# Altium project ESC_control.PrjPCB
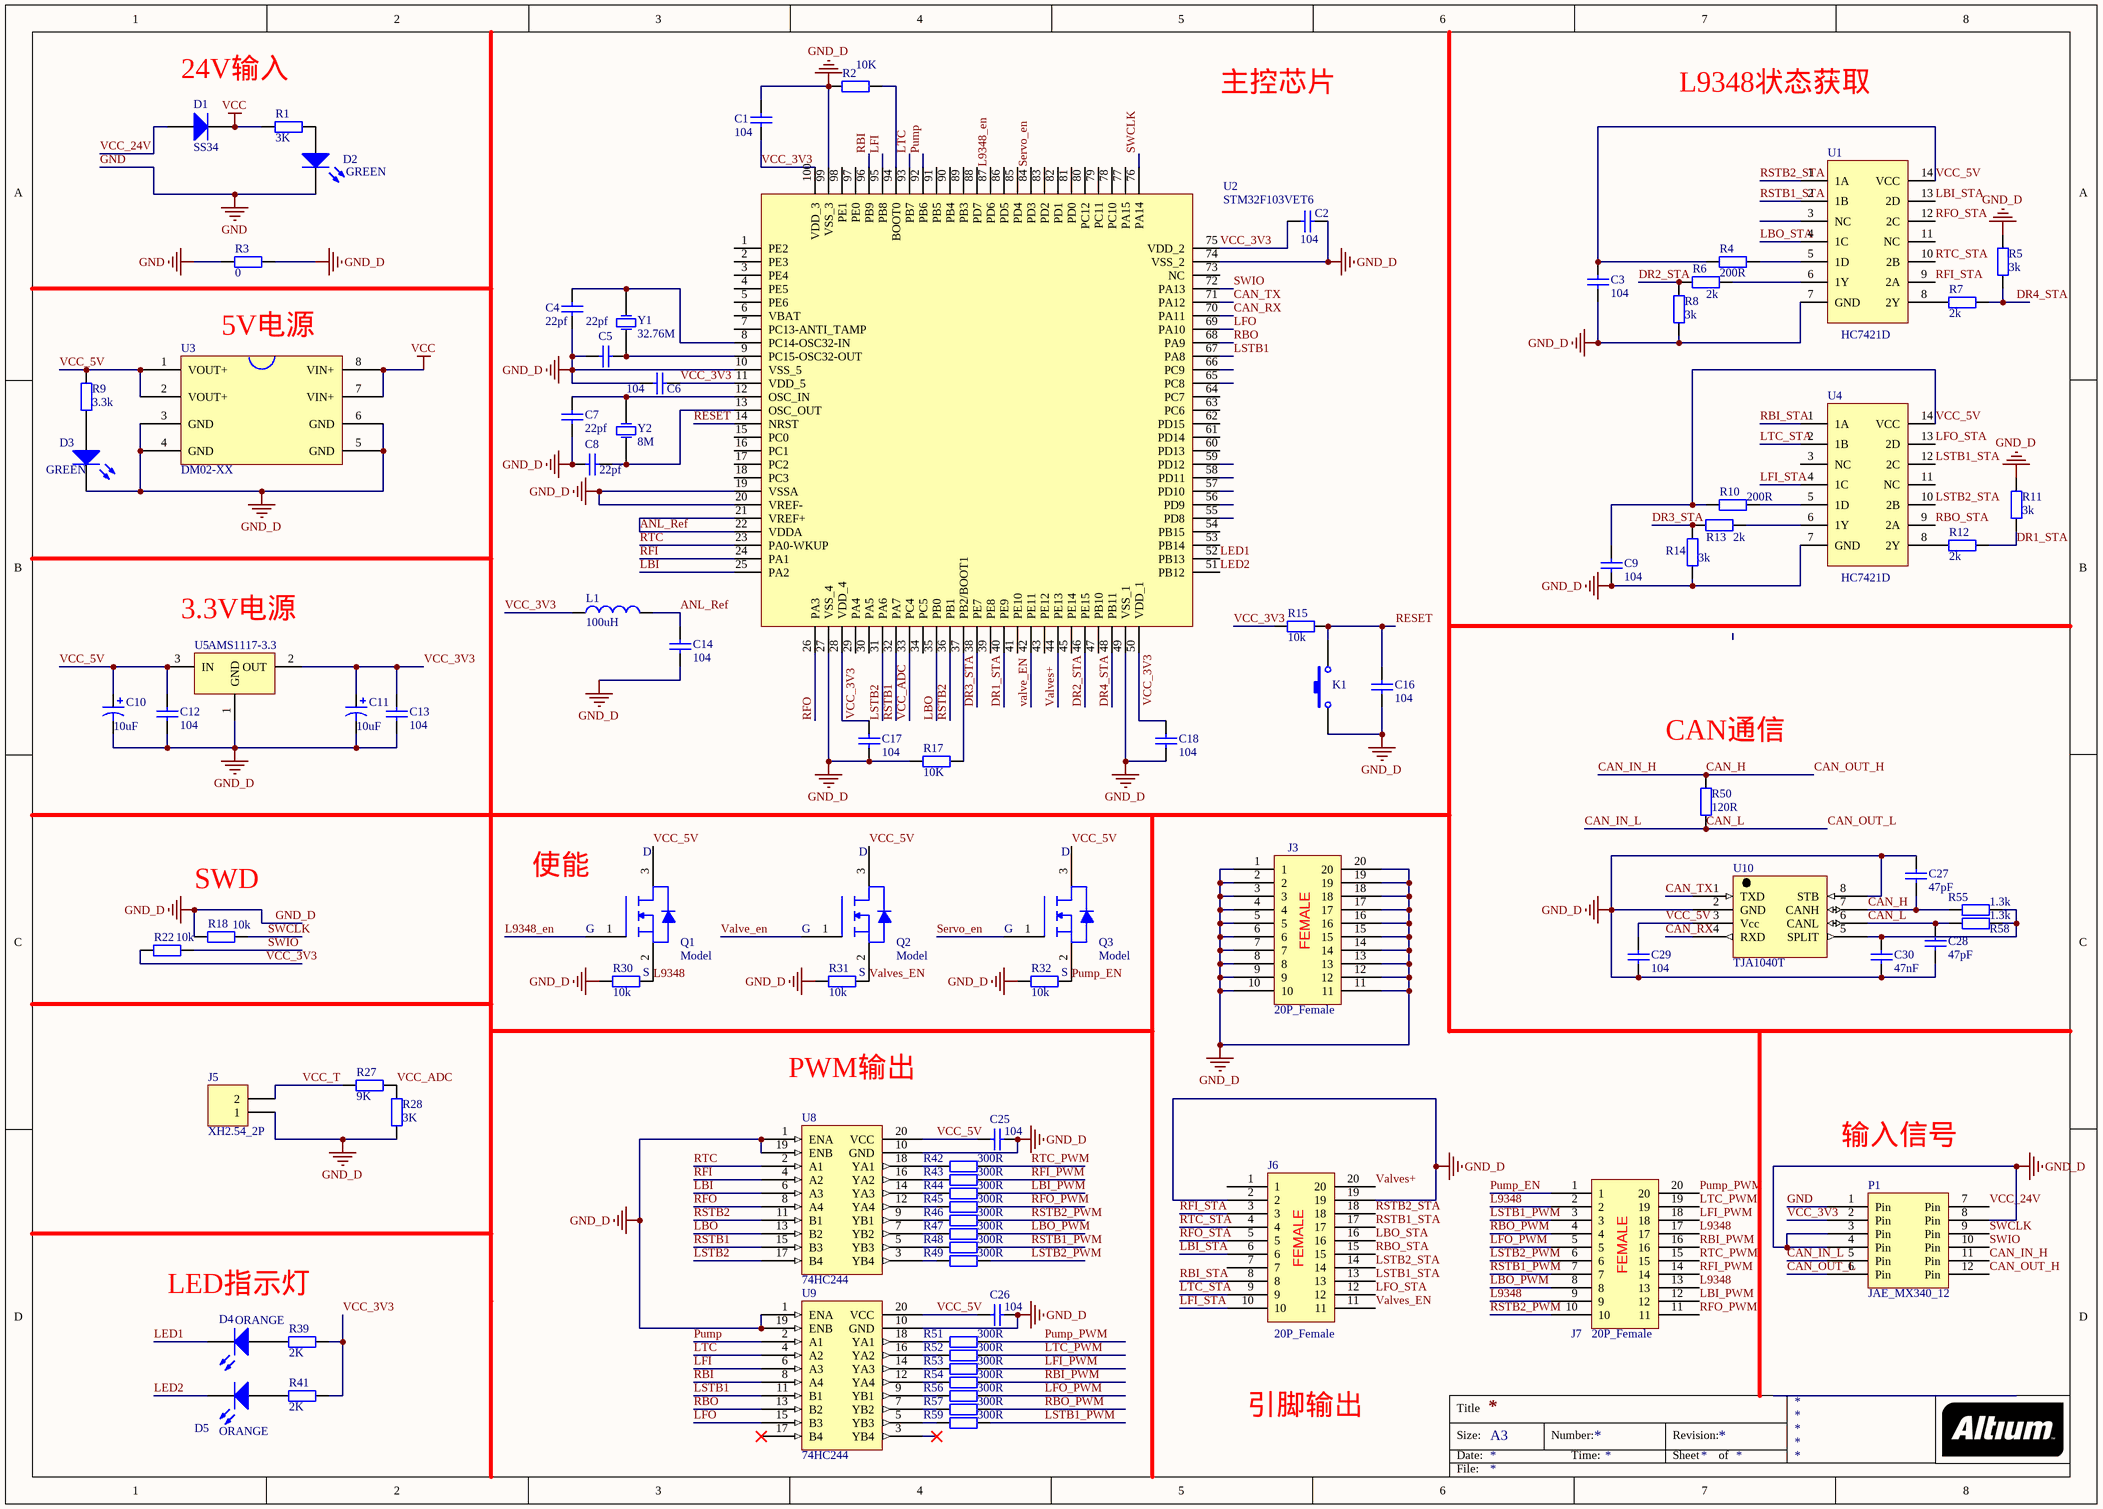
[diagram p0: Controller.SchDoc]
1 sheet, 91 parts. Net scope: global (net labels, ports and power ports of the same name join across sheets).
Board file: ESC_con.PcbDoc

## Sheet Controller.SchDoc
size A3

### Parts
C1  104  [C 0805]
C2  104  [C 0805]
C3  104  [C 0805]
C4  22pf  [C 0805]
C5  22pf  [C 0805]
C6  104  [C 0805]
C7  22pf  [C 0805]
C8  22pf  [C 0805]
C9  104  [C 0805]
C10  10uF  [CP 3528B]
C11  10uF  [CP 3528B]
C12  104  [C 0805]
C13  104  [C 0805]
C14  104  [C 0805]
C16  104  [C 0805]
C17  104  [C 0805]
C18  104  [C 0805]
C25  104  [C 0805]
C26  104  [C 0805]
C27  47pF  [C 0805]
C28  47pF  [C 0805]
C29  104  [C 0805]
C30  47nF  [C 0805]
D1  SS34  [DO-214]
D2  GREEN  [LED_0805]
D3  GREEN  [LED_0805]
D4  ORANGE  [LED_0805]
D5  ORANGE  [LED_0805]
J3  20P_Female  [B2B_1.27_Female]
J5  XH2.54_2P  [XH2.54_2P_SMT]
J6  20P_Female  [B2B_1.27_Female]
J7  20P_Female  [B2B_1.27_Female]
K1  Key  [KEY 3.6*2.5 SMD]  (value not drawn)
L1  100uH  [L 0805]
P1  JAE_MX340_12  [JAE_MX34_2.2_12]
Q1  Model  [SOT23-3]
Q2  Model  [SOT23-3]
Q3  Model  [SOT23-3]
R1  3K  [R 0805]
R2  10K  [R 0805]
R3  0  [R 1206]
R4  200R  [R 0805]
R5  3k  [R 0805]
R6  2k  [R 0805]
R7  2k  [R 0805]
R8  3k  [R 0805]
R9  3.3k  [R 0805]
R10  200R  [R 0805]
R11  3k  [R 0805]
R12  2k  [R 0805]
R13  2k  [R 0805]
R14  3k  [R 0805]
R15  10k  [R 0805]
R17  10K  [R 0805]
R18  10k  [R 0805]
R22  10k  [R 0805]
R27  9K  [R 0805]
R28  3K  [R 0805]
R30  10k  [R 0805]
R31  10k  [R 0805]
R32  10k  [R 0805]
R39  2K  [R 0805]
R41  2K  [R 0805]
R42  300R  [R 0805]
R43  300R  [R 0805]
R44  300R  [R 0805]
R45  300R  [R 0805]
R46  300R  [R 0805]
R47  300R  [R 0805]
R48  300R  [R 0805]
R49  300R  [R 0805]
R50  120R  [R 0805]
R51  300R  [R 0805]
R52  300R  [R 0805]
R53  300R  [R 0805]
R54  300R  [R 0805]
R55  1.3k  [R 0805]
R56  300R  [R 0805]
R57  300R  [R 0805]
R58  1.3k  [R 0805]
R59  300R  [R 0805]
U1  HC7421D  [74hc74]
U2  STM32F103VET6  [TQFP100N50P14X14X1.2]
U3  DM02-XX  [DM02]
U4  HC7421D  [74hc74]
U5  AMS1117-3.3  [SOT223]
U8  74HC244  [SSOP20]
U9  74HC244  [SSOP20]
U10  TJA1040T  [SOP8]
Y1  32.76M  [XTAL-5032]
Y2  8M  [XTAL-5032]

### Nets
GND: D2.2(K) P1.1(Pin) R3.1
GND_D: C1.2 C2.2 C3.1 C4.2 C5.1 C6.1 C7.1 C8.1 C9.1 C10.2 C11.2 C12.1 C13.1 C14.1 C16.1 C17.2 C18.2 C25.2 C26.2 C27.1 C28.2 C29.2 C30.2 D3.2(K) J3.1 J3.2 J3.3 J3.4 J3.5 J3.6 J3.7 J3.8 J3.9 J3.10 J3.11 J3.12 J3.13 J3.14 J3.15 J3.16 J3.17 J3.18 J3.19 J3.20 J5.1 J6.2 J6.19 K1.1 P1.3(Pin) P1.4(Pin) P1.8(Pin) R2.2 R3.2 R5.2 R8.2 R11.2 R14.2 R17.2 R18.1 R28.2 R30.1 R31.1 R32.1 U1.7(GND) U2.10(VSS_5) U2.19(VSSA) U2.20(VREF-) U2.27(VSS_4) U2.49(VSS_1) U2.74(VSS_2) U2.99(VSS_3) U3.3(GND) U3.4(GND) U3.5(GND) U3.6(GND) U4.7(GND) U5.1(GND) U8.1(ENA) U8.10(GND) U8.19(ENB) U9.1(ENA) U9.10(GND) U9.19(ENB) U10.2(GND) U10.8(STB)
VCC: D1.2(K) R1.2 U3.7(VIN+) U3.8(VIN+)
ANL_Ref: C14.2 L1.2 U2.21(VREF+) U2.22(VDDA)
CAN_H: C27.2 P1.11(Pin) P1.12(Pin) R50.2 R55.1 U10.7(CANH)  [also labelled CAN_IN_H, CAN_OUT_H]
CAN_IN_L: C28.1 P1.5(Pin) P1.6(Pin) R50.1 R58.1 U10.6(CANL)  [also labelled CAN_L, CAN_OUT_L]
CAN_RX: U2.70(PA11) U10.4(RXD)
CAN_TX: U2.71(PA12) U10.1(TXD)
DR1_STA: R11.1 R12.1 U2.40(PE9)
DR2_STA: R6.1 R8.1 U2.46(PE15)
DR3_STA: R13.1 R14.1 U2.38(PE7)
DR4_STA: R5.1 R7.1 U2.48(PB11)
L9348: J7.2 J7.9 J7.13 J7.17 Q1.2 R30.2
L9348_en: Q1.1(G) U2.87(PD6)
LBI: U2.25(PA2) U8.6(A3)
LBI_PWM: J7.12 R44.2
LBI_STA: J6.6 U1.13(2D)
LBO: U2.35(PB0) U8.13(B2)
LBO_PWM: J7.8 R47.2
LBO_STA: J6.16 U1.4(1C)
LED1: D4.2(K) U2.52(PB13)
LED2: D5.2(K) U2.51(PB12)
LFI: U2.95(PB8) U9.6(A3)
LFI_PWM: J7.18 R53.2
LFI_STA: J6.10 U4.4(1C)
LFO: U2.69(PA10) U9.15(B3)
LFO_PWM: J7.5 R56.2
LFO_STA: J6.12 U4.13(2D)
LSTB1: U2.67(PA8) U9.11(B1)
LSTB1_PWM: J7.3 R59.2
LSTB1_STA: J6.13 U4.12(2C)
LSTB2: U2.31(PA6) U8.17(B4)
LSTB2_PWM: J7.6 R49.2
LSTB2_STA: J6.14 U4.10(2B)
LTC: U2.93(PB7) U9.4(A2)
LTC_PWM: J7.19 R52.2
LTC_STA: J6.9 U4.2(1B)
Pump: U2.92(PB6) U9.2(A1)
Pump_EN: J7.1 Q3.2 R32.2
Pump_PWM: J7.20 R51.2
RBI: U2.96(PB9) U9.8(A4)
RBI_PWM: J7.16 R54.2
RBI_STA: J6.8 U4.1(1A)
RBO: U2.68(PA9) U9.13(B2)
RBO_PWM: J7.4 R57.2
RBO_STA: J6.15 U4.9(2A)
RESET: C16.2 K1.2 R15.2 U2.14(NRST)
RFI: U2.24(PA1) U8.4(A2)
RFI_PWM: J7.14 R43.2
RFI_STA: J6.3 U1.9(2A)
RFO: U2.26(PA3) U8.8(A4)
RFO_PWM: J7.11 R45.2
RFO_STA: J6.5 U1.12(2C)
RSTB1: U2.32(PA7) U8.15(B3)
RSTB1_PWM: J7.7 R48.2
RSTB1_STA: J6.17 U1.2(1B)
RSTB2: U2.36(PB1) U8.11(B1)
RSTB2_PWM: J7.10 R46.2
RSTB2_STA: J6.18 U1.1(1A)
RTC: U2.23(PA0-WKUP) U8.2(A1)
RTC_PWM: J7.15 R42.2
RTC_STA: J6.4 U1.10(2B)
Servo_en: Q3.1(G) U2.84(PD3)
SWCLK: P1.9(Pin) R18.2 U2.76(PA14)
SWIO: P1.10(Pin) R22.2 U2.72(PA13)
Valve_en: Q2.1(G) U2.42(PE11)
Valves+: J6.20 U2.44(PE13)
Valves_EN: J6.11 Q2.2 R31.2
VCC_3V3: C1.1 C2.1 C6.2 C11.1 C13.2 C17.1 C18.1 L1.1 P1.2(Pin) R15.1 R22.1 R39.1 R41.1 U2.11(VDD_5) U2.28(VDD_4) U2.50(VDD_1) U2.75(VDD_2) U2.100(VDD_3) U5.2(OUT)
VCC_5V: C3.2 C9.2 C10.1 C12.2 C25.1 C26.1 C29.1 Q1.3 Q2.3 Q3.3 R4.2 R9.2 R10.2 U1.14(VCC) U3.1(VOUT+) U3.2(VOUT+) U4.14(VCC) U5.3(IN) U8.20(VCC) U9.20(VCC) U10.3(Vcc)
VCC_24V: D1.1(A) P1.7(Pin)
VCC_ADC: R27.1 R28.1 U2.33(PC4)
VCC_T: J5.2 R27.2
NetC4_1: C4.1 U2.8(PC14-OSC32-IN) Y1.2(OSC2)
NetC5_2: C5.2 U2.9(PC15-OSC32-OUT) Y1.1(OSC1)
NetC7_2: C7.2 U2.12(OSC_IN) Y2.2(OSC2)
NetC8_2: C8.2 U2.13(OSC_OUT) Y2.1(OSC1)
NetC30_1: C30.1 R55.2 R58.2 U10.5(SPLIT)
NetD2_1: D2.1(A) R1.1
NetD3_1: D3.1(A) R9.1
NetD4_1: D4.1(A) R39.2
NetD5_1: D5.1(A) R41.2
NetR2_1: R2.1 U2.94(BOOT0)
NetR4_1: R4.1 U1.5(1D)
NetR6_2: R6.2 U1.6(1Y)
NetR7_2: R7.2 U1.8(2Y)
NetR10_1: R10.1 U4.5(1D)
NetR12_2: R12.2 U4.8(2Y)
NetR13_2: R13.2 U4.6(1Y)
NetR17_1: R17.1 U2.37(PB2/BOOT1)
NetR42_1: R42.1 U8.18(YA1)
NetR43_1: R43.1 U8.16(YA2)
NetR44_1: R44.1 U8.14(YA3)
NetR45_1: R45.1 U8.12(YA4)
NetR46_1: R46.1 U8.9(YB1)
NetR47_1: R47.1 U8.7(YB2)
NetR48_1: R48.1 U8.5(YB3)
NetR49_1: R49.1 U8.3(YB4)
NetR51_1: R51.1 U9.18(YA1)
NetR52_1: R52.1 U9.16(YA2)
NetR53_1: R53.1 U9.14(YA3)
NetR54_1: R54.1 U9.12(YA4)
NetR56_1: R56.1 U9.9(YB1)
NetR57_1: R57.1 U9.7(YB2)
NetR59_1: R59.1 U9.5(YB3)

Not connected (* = marked no-connect by the designer): J6 1 7; U1 3(NC) 11(NC); U2 1(PE2) 2(PE3) 3(PE4) 4(PE5) 5(PE6) 6(VBAT) 7(PC13-ANTI_TAMP) 15(PC0) 16(PC1) 17(PC2) 18(PC3) 29(PA4) 30(PA5) 34(PC5) 39(PE8) 41(PE10) 43(PE12) 45(PE14) 47(PB10) 53(PB14) 54(PB15) 55(PD8) 56(PD9) 57(PD10) 58(PD11) 59(PD12) 60(PD13) 61(PD14) 62(PD15) 63(PC6) 64(PC7) 65(PC8) 66(PC9) 73(NC) 77(PA15) 78(PC10) 79(PC11) 80(PC12) 81(PD0) 82(PD1) 83(PD2) 85(PD4) 86(PD5) 88(PD7) 89(PB3) 90(PB4) 91(PB5) 97(PE0) 98(PE1); U4 3(NC) 11(NC); U9 3(YB4)* 17(B4)*

### Notes on the sheet
- 24V输入
- 主控芯片
- L9348状态获取
- (near U3) 5V电源
- (near U5) 3.3V电源
- (near R50) CAN通信
- SWD
- 使能
- PWM输出
- 输入信号
- LED指示灯
- 引脚输出
- Title
- Size:
- Date:
- A3
- Number:
- Time:
- Revision:
- Sheet
- of
- File:
- (in symbol B2B_1.27_Female) FEMALE
- (in symbol MOSFET_N) D; S

### Library data of the parts
C1-C9 C12-C14 C16-C18 C25-C30 = Cap: 无极性电容
C10 C11 = Cap_Pol: 极性电容
D1 = Diode: 二极管
D2-D5 = LED: 发光二极管
J3 J6 J7 = B2B_1.27_Female: 板对板连接器 母头
K1 = Key: 按键
L1 = Inductor: 电感
P1 = JAE_MX34012NF1
Q1-Q3 = MOSFET_N: N沟道MOS管
R1-R15 R17 R18 R22 R27 R28 R30-R32 R39 R41-R59 = Resistor: 电阻
U2 = STM32F103RBT6: Published: 20110607
U3 = DM02: 开关型DC-DC变换器
U5 = AMS1117: 线性稳压器
U8 U9 = 74HC244: CMOS工艺8通道缓冲器
U10 = TJA1040T: 高速CAN收发器
Y1 Y2 = XTAL: 晶振